# Altium schematic sheet IOPower.SchDoc: HPBI Controller
size B; ApprovedBy: J Johnson; CheckedBy: J Johnson; Author: sdfasdfdfAEFfasdFfaF; DrawnBy: J Johnson; Organization: Opsero Electronic Design; Address1: 21-915 Av. Marguerite-Bourgeoys; Address2: Québec (QC); Address3: G1S 3X4; DocumentNumber: OP009-001-SCH; Revision: 1.0; SheetNumber: 14; SheetTotal: 16; Tel1: (581) 308-8830; Tel2: (581) 308-8830; Project: HPBI Controller; CheckedDate: 2013-12-13; Sheet: IO Power Supplies; PageSetup: Record=PageOptions|CenterHorizontal=True|CenterVertical=True|PrintScale=1.08|XCorrection=1.00|YCorrection=1.00|PrintKind=0|BorderSize=5000000|LeftOffset=0|BottomOffset=0|Orientation=2|PaperLength=1000|PaperWidth=1000|Scale=100|PaperSource=7|PrintQuality=-4|MediaType=1|DitherType=10|PaperKind=Tabloid     [11 x 17 in]|PrintScaleMode=1; DrawDate: 2013-12-13; SchTitle: HPBI Controller; RevDescription: Preliminary; RevDate: 2014-01-29; RevBy: J Johnson
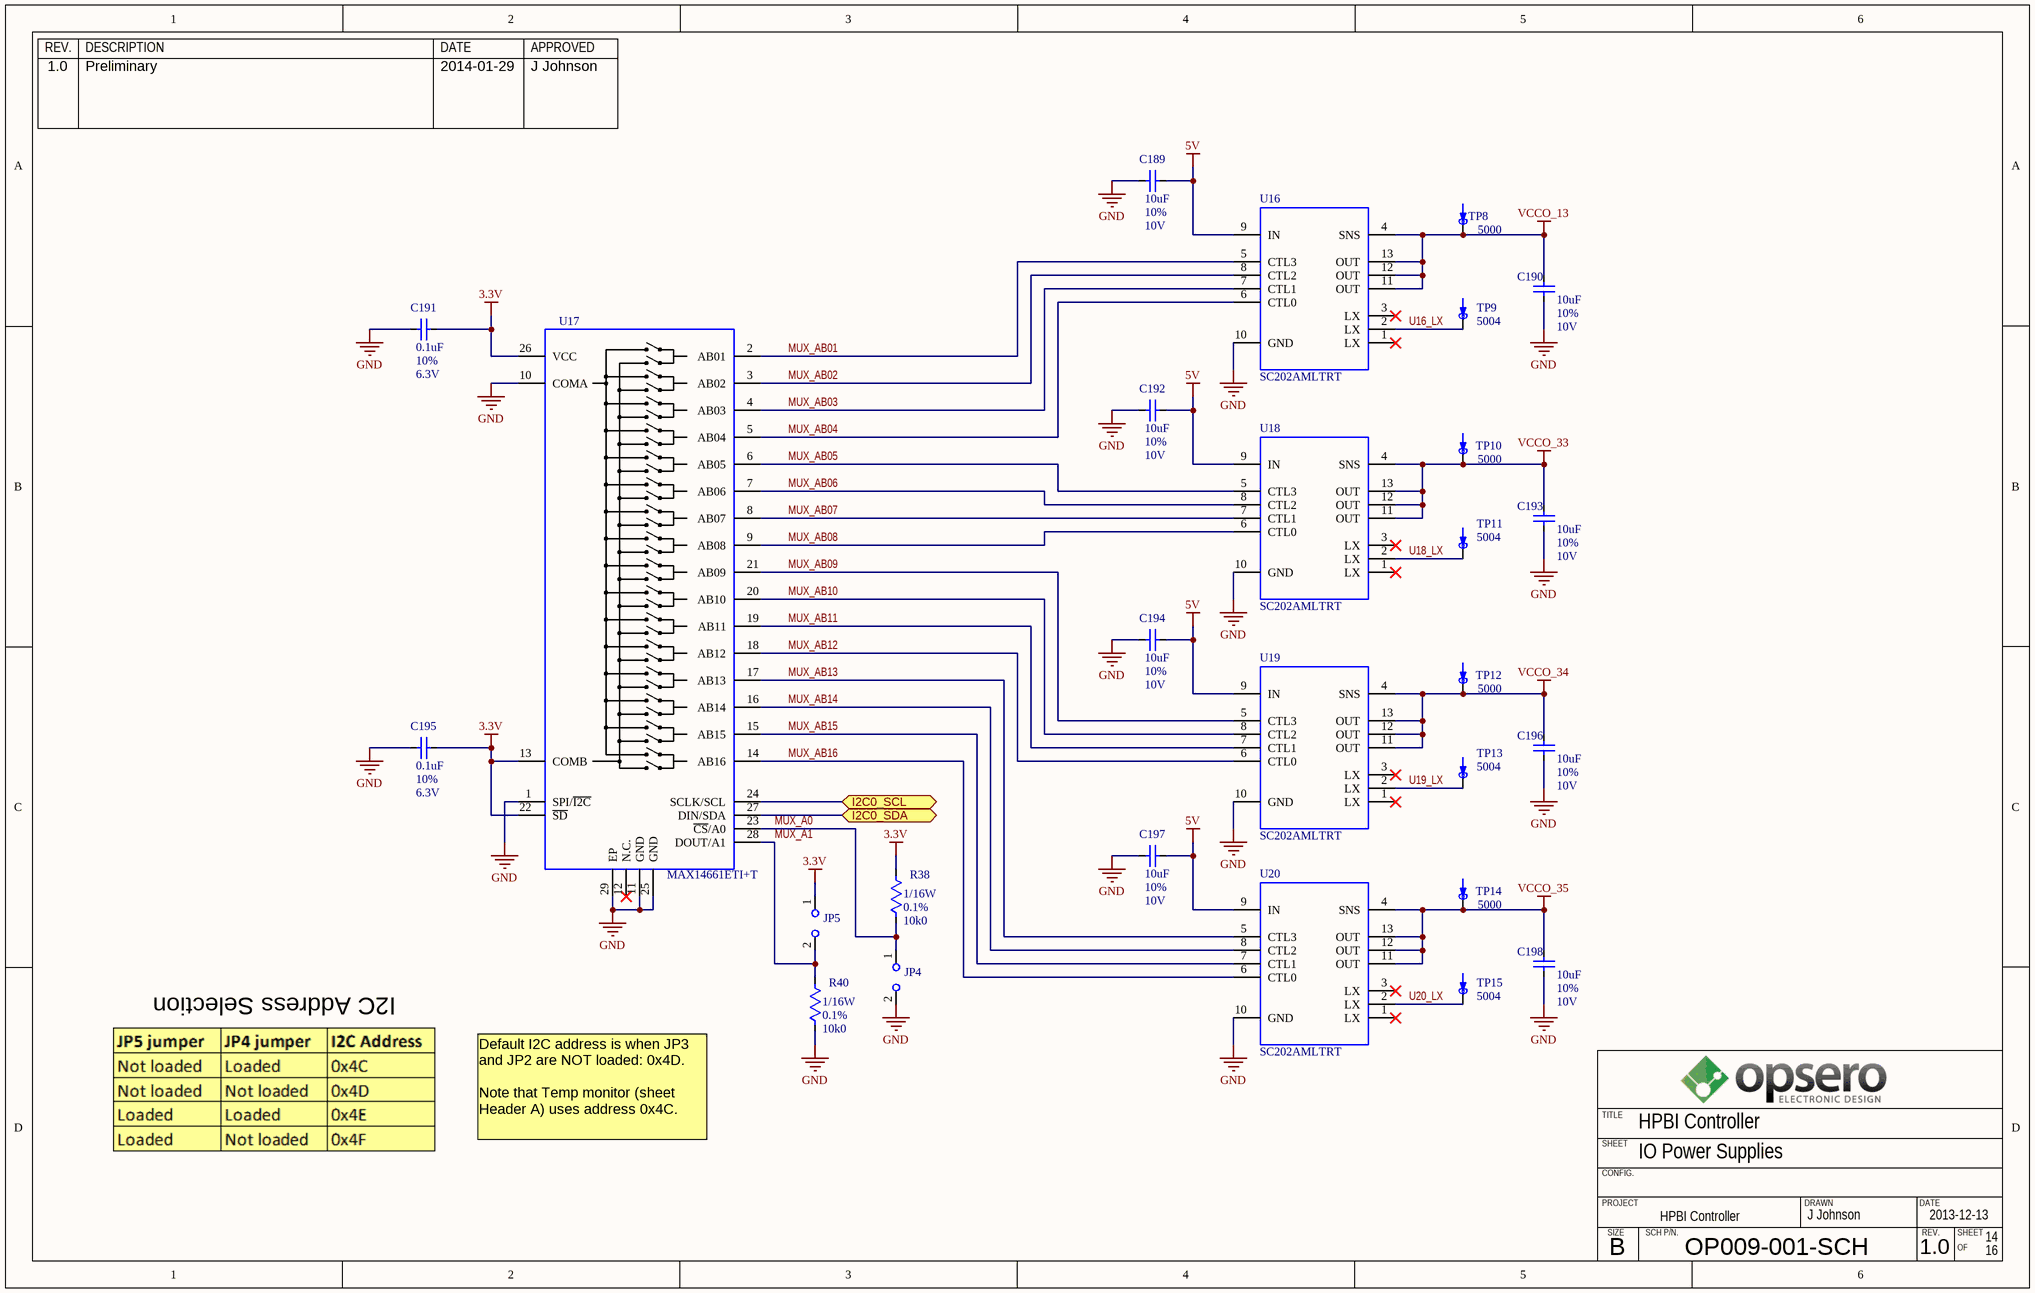
[diagram p0: IOPower.SchDoc]

## Parts
C189  value 10uF  Tolerance: 10%  Voltage: 10V  [CAPC1608X38N]  (hidden comment: CAPACITOR_NP_TYPE1)
C190  value 10uF  Tolerance: 10%  Voltage: 10V  [CAPC1608X38N]  (hidden comment: CAPACITOR_NP_TYPE1)
C191  value 0.1uF  Tolerance: 10%  Voltage: 6.3V  [CAPC0603X33N]  (hidden comment: CAPACITOR_NP_TYPE1)
C192  value 10uF  Tolerance: 10%  Voltage: 10V  [CAPC1608X38N]  (hidden comment: CAPACITOR_NP_TYPE1)
C193  value 10uF  Tolerance: 10%  Voltage: 10V  [CAPC1608X38N]  (hidden comment: CAPACITOR_NP_TYPE1)
C194  value 10uF  Tolerance: 10%  Voltage: 10V  [CAPC1608X38N]  (hidden comment: CAPACITOR_NP_TYPE1)
C195  value 0.1uF  Tolerance: 10%  Voltage: 6.3V  [CAPC0603X33N]  (hidden comment: CAPACITOR_NP_TYPE1)
C196  value 10uF  Tolerance: 10%  Voltage: 10V  [CAPC1608X38N]  (hidden comment: CAPACITOR_NP_TYPE1)
C197  value 10uF  Tolerance: 10%  Voltage: 10V  [CAPC1608X38N]  (hidden comment: CAPACITOR_NP_TYPE1)
C198  value 10uF  Tolerance: 10%  Voltage: 10V  [CAPC1608X38N]  (hidden comment: CAPACITOR_NP_TYPE1)
JP4  JP_HDR2x1  [961102-6404-AR]  (value not drawn)
JP5  JP_HDR2x1  [961102-6404-AR]  (value not drawn)
R38  value 10k0  Power: 1/16W  Tolerance: 0.1%  [RESC1005X33N]  (hidden comment: *)
R40  value 10k0  Power: 1/16W  Tolerance: 0.1%  [RESC1005X33N]  (hidden comment: *)
TP8  value 5000  [KEY_5000]  (hidden comment: TEST_POINT_TYPE4)
TP9  value 5004  [KEY_5004]  (hidden comment: TEST_POINT_TYPE4)
TP10  value 5000  [KEY_5000]  (hidden comment: TEST_POINT_TYPE4)
TP11  value 5004  [KEY_5004]  (hidden comment: TEST_POINT_TYPE4)
TP12  value 5000  [KEY_5000]  (hidden comment: TEST_POINT_TYPE4)
TP13  value 5004  [KEY_5004]  (hidden comment: TEST_POINT_TYPE4)
TP14  value 5000  [KEY_5000]  (hidden comment: TEST_POINT_TYPE4)
TP15  value 5004  [KEY_5004]  (hidden comment: TEST_POINT_TYPE4)
U16  SC202AMLTRT  [QFN40P250X300X90-13N]
U17  Mfg Part Number 1: MAX14661ETI+T  [QFN40P400X400X75-29N]  (hidden comment: MAX14661)
U18  SC202AMLTRT  [QFN40P250X300X90-13N]
U19  SC202AMLTRT  [QFN40P250X300X90-13N]
U20  SC202AMLTRT  [QFN40P250X300X90-13N]

## Ports
I2C0_SCL (bidir), I2C0_SDA (bidir)

## Nets
3.3V: C191.1 C195.1 JP5.1 R38.1 U17.13(COMB) U17.22(~{SD}) U17.26(VCC)
5V: C189.1 C192.1 C194.1 C197.1 U16.9(IN) U18.9(IN) U19.9(IN) U20.9(IN)
GND: C189.2 C190.2 C191.2 C192.2 C193.2 C194.2 C195.2 C196.2 C197.2 C198.2 JP4.2 R40.2 U16.10(GND) U17.1(SPI/~{I2C}) U17.10(COMA) U17.11(GND) U17.25(GND) U17.29(EP) U18.10(GND) U19.10(GND) U20.10(GND)
VCCO_13: C190.1 TP8.1 U16.4(SNS) U16.11(OUT) U16.12(OUT) U16.13(OUT)
VCCO_33: C193.1 TP10.1 U18.4(SNS) U18.11(OUT) U18.12(OUT) U18.13(OUT)
VCCO_34: C196.1 TP12.1 U19.4(SNS) U19.11(OUT) U19.12(OUT) U19.13(OUT)
VCCO_35: C198.1 TP14.1 U20.4(SNS) U20.11(OUT) U20.12(OUT) U20.13(OUT)
I2C0_SCL: U17.24(SCLK/SCL) ; port I2C0_SCL
I2C0_SDA: U17.27(DIN/SDA) ; port I2C0_SDA
MUX_A0: JP4.1 R38.2 U17.23(~{CS}/A0)
MUX_A1: JP5.2 R40.1 U17.28(DOUT/A1)
MUX_AB01: U16.5(CTL3) U17.2(AB01)
MUX_AB02: U16.8(CTL2) U17.3(AB02)
MUX_AB03: U16.7(CTL1) U17.4(AB03)
MUX_AB04: U16.6(CTL0) U17.5(AB04)
MUX_AB05: U17.6(AB05) U18.5(CTL3)
MUX_AB06: U17.7(AB06) U18.8(CTL2)
MUX_AB07: U17.8(AB07) U18.7(CTL1)
MUX_AB08: U17.9(AB08) U18.6(CTL0)
MUX_AB09: U17.21(AB09) U19.5(CTL3)
MUX_AB10: U17.20(AB10) U19.8(CTL2)
MUX_AB11: U17.19(AB11) U19.7(CTL1)
MUX_AB12: U17.18(AB12) U19.6(CTL0)
MUX_AB13: U17.17(AB13) U20.5(CTL3)
MUX_AB14: U17.16(AB14) U20.8(CTL2)
MUX_AB15: U17.15(AB15) U20.7(CTL1)
MUX_AB16: U17.14(AB16) U20.6(CTL0)
U16_LX: TP9.1 U16.2(LX)
U18_LX: TP11.1 U18.2(LX)
U19_LX: TP13.1 U19.2(LX)
U20_LX: TP15.1 U20.2(LX)

Not connected (* = marked no-connect by the designer): U16 1(LX)* 3(LX)*; U17 12(N.C.)*; U18 1(LX)* 3(LX)*; U19 1(LX)* 3(LX)*; U20 1(LX)* 3(LX)*

## Notes on the sheet
- I2C Address Selection
- Default I2C address is when JP3 and JP2 are NOT loaded: 0x4D.
  Note that Temp monitor (sheet Header A) uses address 0x4C.
- REV.
- DESCRIPTION
- DATE
- APPROVED
- SHEET
- TITLE
- CONFIG.
- PROJECT
- SIZE
- SCH P/N.
- DRAWN
- B
- OF

## Library data of the parts
C189 C190 C192-C194 C196-C198 = C0603_10uF_10%_10V_X5R: Capacitor ceramic, X5R, 10uF, 10V, 10%, -55 to +85 C, EIA0603; Manufacturer 1: TDK Corporation; Mfg Part Number 1: C1608X5R1A106K080AC; EIA(I) Package: 0603; EIA(M) Package: 1608; ASSY: USED; Status: Active; Power: *; Current: *; Part Ref: C0603_10uF_10%_10V_X5R; Comment_1: *; RoHs: True; Operating Temp: -55 to +85 C
C191 C195 = C0201_0.1uF_10%_6.3V_X5R: Capacitor ceramic, X5R, 0.1uF, 6.3V, 10%, -55 to +125 C, EIA0201; Manufacturer 1: Murata; Mfg Part Number 1: GRM033R60J104KE19D; EIA(I) Package: 0201; EIA(M) Package: 0603; ASSY: USED; Status: Active; Power: *; Current: *; Part Ref: C0201_0.1uF_10%_6.3V_X5R; Comment_1: *; RoHs: True; Operating Temp: -55 to +85 C
JP4 JP5 = JP_HDR2x1: Jumper Header .100'', 2-pin, TH; Manufacturer 1: 3M; ASSY: USED; Power: Pow; Current: Cur; Voltage: Vol; Value: 961102-6404-AR; Status: Active; EIA(I) Package: *; EIA(M) Package: *; Part Ref: JP_HDR2x1; Tolerance: *; Package: *; RoHs: True; Mfg Part Number 1: 961102-6404-AR; Datasheet 1: ..\datasheet\Connector\TYCO_TE\640456-8
R38 R40 = R0402_10k0_0.1%: Resistor, 10k0, 1/16W, 0.1%, -50 to +155 C, EIA0402; Manufacturer 1: Panasonic - ECG; Mfg Part Number 1: ERA-2AEB103X; EIA(I) Package: 0402; EIA(M) Package: 1005; Voltage: 50V; ASSY: USED; Status: Active; Part Ref: R0402_10k0_0.1%; Current: *; Comment_1: *; RoHs: True; Package: 0402; Operating Temp: -50 to +155 C; Datasheet 1: ..\datasheet\Resistor\Panasonic ECG\ERA\2012-10-25; Manufacturer 2: Vishay Dale; Mfg Part Number 2: TNPW040210K0BEED; Datasheet 2: ..\datasheet\Resistor\Vishay Dale\TNPW\2012-03-29
TP8 TP10 TP12 TP14 = 5000: Test point bead, red, Keystone Electronics, Thru-hole,; Manufacturer 1: Keystone inc; ASSY: USED; Power: Pow; Current: Cur; Voltage: Vol; Comment_1: Com; Status: Active; EIA(I) Package: *; EIA(M) Package: *; Part Ref: 5000; Tolerance: *; Package: *; RoHs: True; Mfg Part Number 1: 5000; Datasheet 1: ..\datasheet\Connector\Keystone Electronics\5001-5014\2012-06-28
TP9 TP11 TP13 TP15 = 5004: Test point bead, yellow, Keystone Electronics, Thru-hole,; Manufacturer 1: Keystone inc; ASSY: USED; Power: Pow; Current: Cur; Voltage: Vol; Comment_1: Com; Status: Active; EIA(I) Package: *; EIA(M) Package: *; Part Ref: 5004; Tolerance: *; Package: *; RoHs: True; Mfg Part Number 1: 5004; Datasheet 1: ..\datasheet\Connector\Keystone Electronics\5001-5014\2012-06-28
U16 U18-U20 = SC202AMLTRT: Regulator Step-down, 13-pin, 0.8V to 3.3V, 500mA, SMT, -40 to +85C, MLPQ-13; Manufacturer 1: Semtech; Part Ref: SC202AMLTRT; Status: Active; RoHs: True; Value: SC202AMLTRT; Voltage: 0.8V to 3.3V; Current: 500mA; Operating Temp: -40 to +85 C; Mfg Part Number 1: SC202AMLTRT; Package: MLPQ-13
U17 = MAX14661ETI+T: Analog MUX, 16 to 2, BiCMOS; Manufacturer 1: Maxim; Voltage: +1.6V to +5.5V; Part Ref: MAX14661ETI+T; Status: Active; RoHs: True; Operating Temp: -40 to +85 C; Manufacturer 2: Maxim